# EAGLE schematic RX TX (EAGLE 9.6.2)
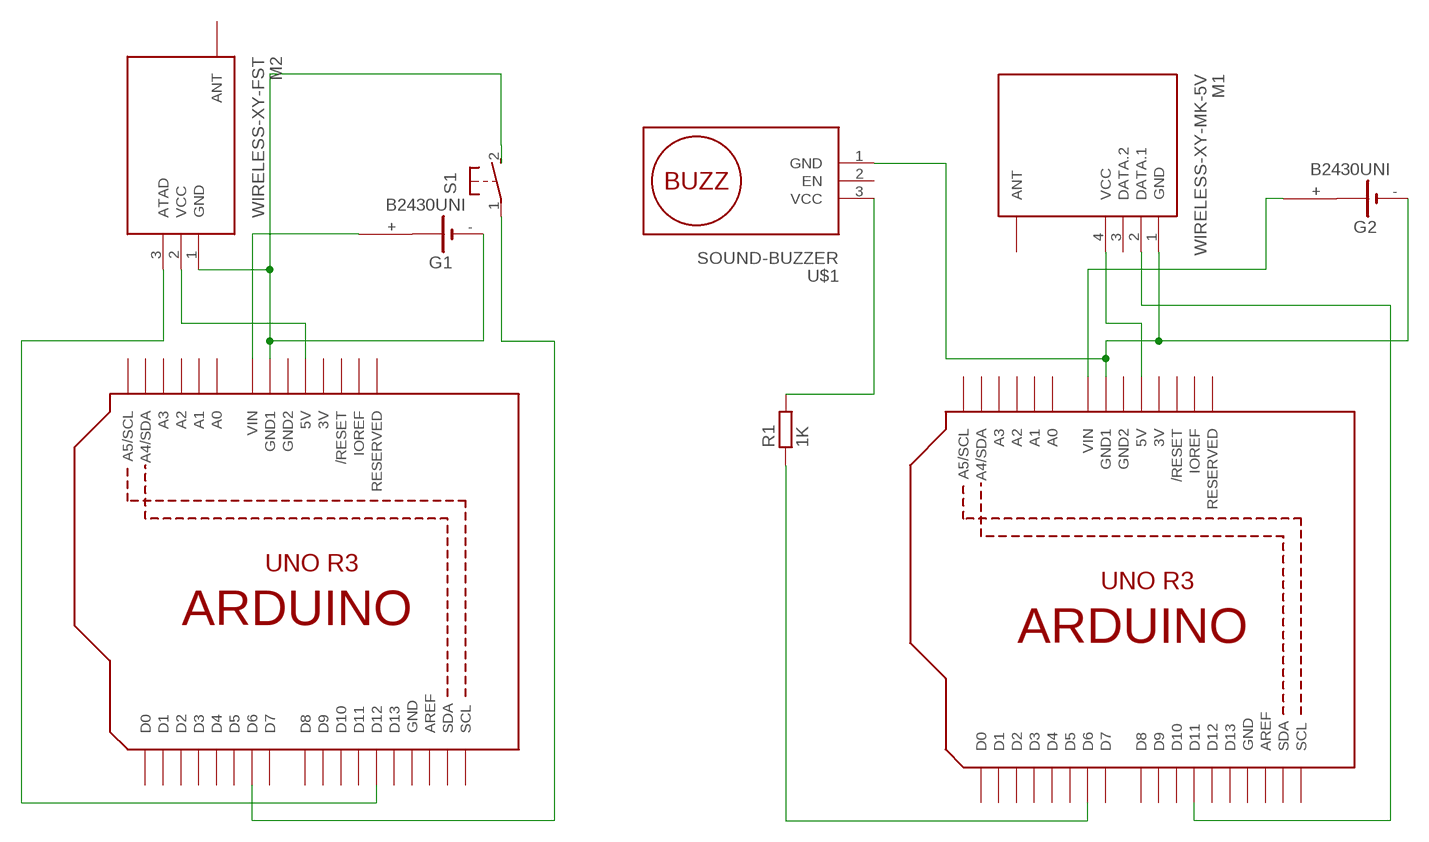
[diagram p0: schematic, sheet 1]

## Parts
G1  B2430UNI  [B2430UNI]
G2  B2430UNI  [B2430UNI]
M1  WIRELESS-XY-MK-5V  [WIRELESS-XY-MK-5V]
M2  WIRELESS-XY-FST  [WIRELESS-XY-FST]
R1  1K  RESISTOR_0201  [RESC0603X30N]
S1  DTS-3  [DTS-3]
U1  ARDUINOR3-BPLACE  [ARDUINOR3-BPLACE]
U2  ARDUINOR3-BPLACE  [ARDUINOR3-BPLACE]
U$1  SOUND-BUZZER  [SOUND-BUZZER]

## Nets
N$1: M2.2(VCC) U2.5V
N$2: G1.- M2.1(GND) S1.2 U2.GND1
N$3: M1.4(VCC) U1.5V
N$4: G2.- M1.1(GND) U1.GND1 U$1.1(GND)
N$5: M1.2(DATA.1) U1.D11
N$6: S1.1 U2.D6
N$7: M2.3(ATAD) U2.D12
N$8: R1.1 U1.D6
N$9: R1.2 U$1.3(VCC)
N$11: G1.+ U2.VIN
N$12: G2.+ U1.VIN
Unconnected: G1.+@1(+) G1.+@2(+) G1.+@3(+) G1.+@4(+) G1.-@1(-) G2.+@1(+) G2.+@2(+) G2.+@3(+) G2.+@4(+) G2.-@1(-) M1.3(DATA.2) M1.ANT M2.ANT U1.A0 U1.A1 U1.A2 U1.A3 U1.A4(A4/SDA) U1.A5(A5/SCL) U1.AREF U1.D0 U1.D1 U1.D2 U1.D3 U1.D4 U1.D5 U1.D7 U1.D8 U1.D9 U1.D10 U1.D12 U1.D13 U1.IOREF U1.RESERVED U1.RESET(/RESET) U1.SCL U1.SDA U2.A0 U2.A1 U2.A2 U2.A3 U2.A4(A4/SDA) U2.A5(A5/SCL) U2.AREF U2.D0 U2.D1 U2.D2 U2.D3 U2.D4 U2.D5 U2.D7 U2.D8 U2.D9 U2.D10 U2.D11 U2.D13 U2.IOREF U2.RESERVED U2.RESET(/RESET) U2.SCL U2.SDA U$1.2(EN)

## Power pins joined to a net without a drawn wire
3V: U1.3V U2.3V
GND: U1.GND U2.GND
GND2: U1.GND2 U2.GND2

## Library data of the parts
G1 G2 = battery:B2430UNI: LI BATTERY
M1 = diy-modules:WIRELESS-XY-MK-5V: RF Wireless XY-MK-5V Receiver Click here to find device on ebay.com <http://www.ebay.com/sch/xd+rf+5v-receiver> Note: Sold together with transmitter.
M2 = diy-modules:WIRELESS-XY-FST: RF Wireless XY-FST Transmitter Click here to find device on ebay.com <http://www.ebay.com/sch/xd+fst+transmitter> Note: Sold together with receiver.
R1 = ipc-7351-resistor:RESISTOR_
S1 = push:DTS-3
U1 U2 = adafruit:ARDUINOR3: This is a new object for the new Arduino R3 - with extra pins that you may want to use (such as IOref, and duplicated A4/A5
U$1 = diy-modules:SOUND-BUZZER: Sound Buzzer Module Click here to find device on ebay.com <http://www.ebay.com/sch/passive+buzzer+beep+module>